# Altium schematic sheet ESP32 with USBC.SchDoc
size C; SheetNumber: 1; SheetTotal: 1
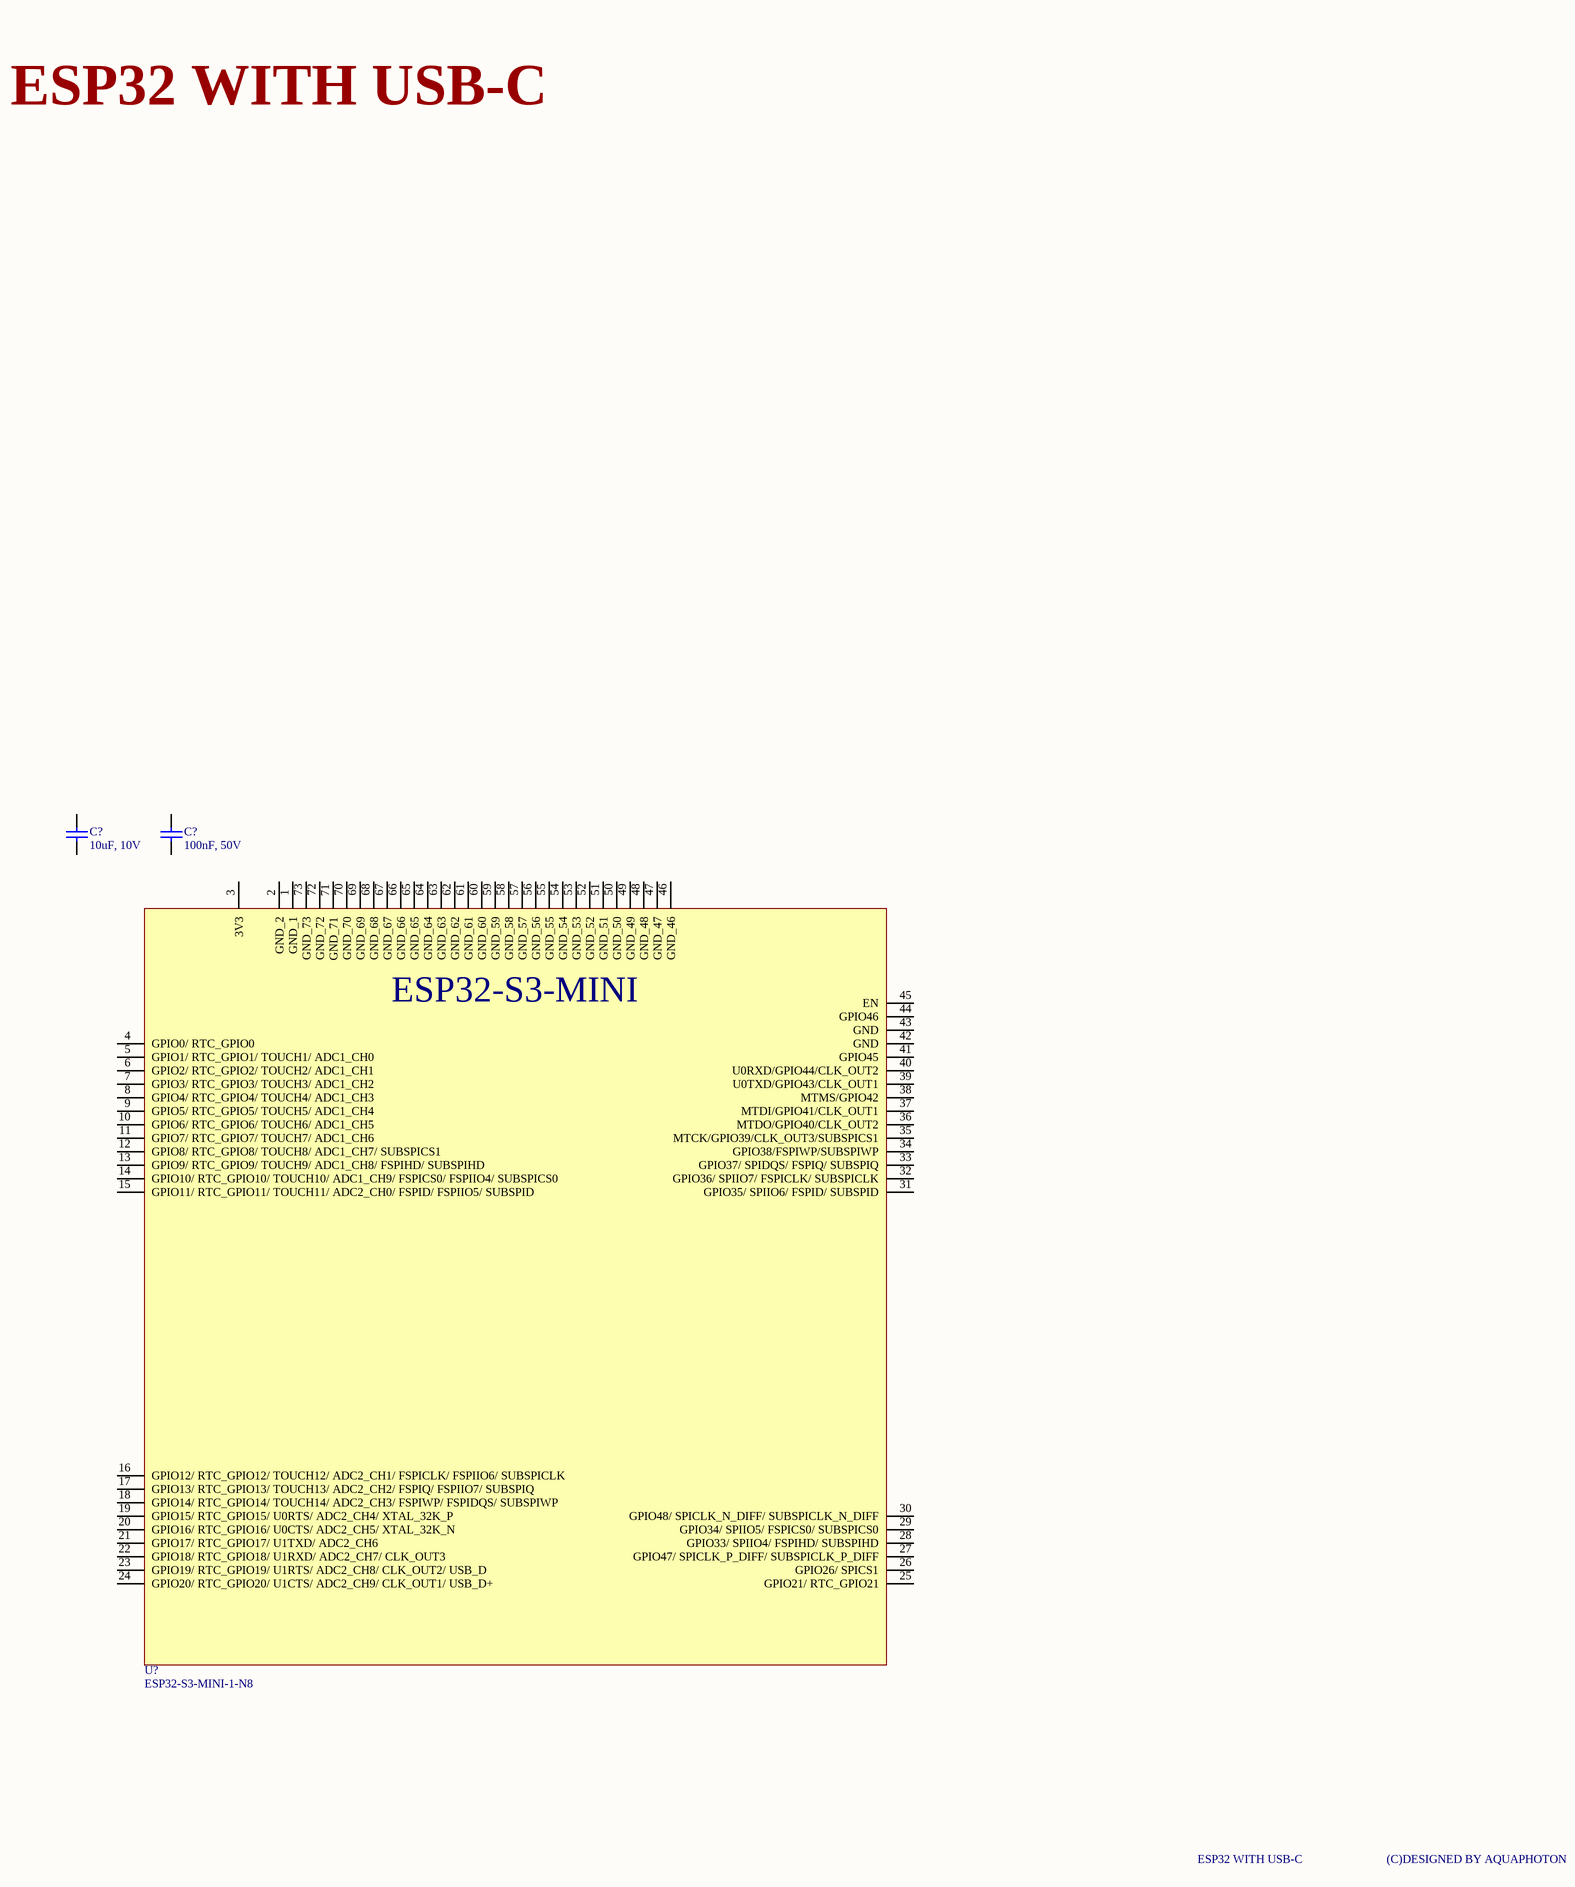
[diagram p0: ESP32 with USBC.SchDoc]

## Parts
(Parts that share a designator on the sheet are numbered #1, #2 ... from top to bottom, then left to right.)
C?#1  10uF, 10V
C?#2  100nF, 50V
U?  ESP32-S3-MINI-1-N8

## Nets

Not connected (* = marked no-connect by the designer): C?#1 1 2; C?#2 1 2; U? 1(GND_1) 2(GND_2) 3(3V3) 4(GPIO0/_RTC_GPIO0) 5(GPIO1/_RTC_GPIO1/_TOUCH1/_ADC1_CH0) 6(GPIO2/_RTC_GPIO2/_TOUCH2/_ADC1_CH1) 7(GPIO3/_RTC_GPIO3/_TOUCH3/_ADC1_CH2) 8(GPIO4/_RTC_GPIO4/_TOUCH4/_ADC1_CH3) 9(GPIO5/_RTC_GPIO5/_TOUCH5/_ADC1_CH4) 10(GPIO6/_RTC_GPIO6/_TOUCH6/_ADC1_CH5) 11(GPIO7/_RTC_GPIO7/_TOUCH7/_ADC1_CH6) 12(GPIO8/_RTC_GPIO8/_TOUCH8/_ADC1_CH7/_SUBSPICS1) 13(GPIO9/_RTC_GPIO9/_TOUCH9/_ADC1_CH8/_FSPIHD/_SUBSPIHD) 14(GPIO10/_RTC_GPIO10/_TOUCH10/_ADC1_CH9/_FSPICS0/_FSPIIO4/_SUBSPICS0) 15(GPIO11/_RTC_GPIO11/_TOUCH11/_ADC2_CH0/_FSPID/_FSPIIO5/_SUBSPID) 16(GPIO12/_RTC_GPIO12/_TOUCH12/_ADC2_CH1/_FSPICLK/_FSPIIO6/_SUBSPICLK) 17(GPIO13/_RTC_GPIO13/_TOUCH13/_ADC2_CH2/_FSPIQ/_FSPIIO7/_SUBSPIQ) 18(GPIO14/_RTC_GPIO14/_TOUCH14/_ADC2_CH3/_FSPIWP/_FSPIDQS/_SUBSPIWP) 19(GPIO15/_RTC_GPIO15/_U0RTS/_ADC2_CH4/_XTAL_32K_P) 20(GPIO16/_RTC_GPIO16/_U0CTS/_ADC2_CH5/_XTAL_32K_N) 21(GPIO17/_RTC_GPIO17/_U1TXD/_ADC2_CH6) 22(GPIO18/_RTC_GPIO18/_U1RXD/_ADC2_CH7/_CLK_OUT3) 23(GPIO19/_RTC_GPIO19/_U1RTS/_ADC2_CH8/_CLK_OUT2/_USB_D) 24(GPIO20/_RTC_GPIO20/_U1CTS/_ADC2_CH9/_CLK_OUT1/_USB_D+) 25(GPIO21/_RTC_GPIO21) 26(GPIO26/_SPICS1) 27(GPIO47/_SPICLK_P_DIFF/_SUBSPICLK_P_DIFF) 28(GPIO33/_SPIIO4/_FSPIHD/_SUBSPIHD) 29(GPIO34/_SPIIO5/_FSPICS0/_SUBSPICS0) 30(GPIO48/_SPICLK_N_DIFF/_SUBSPICLK_N_DIFF) 31(GPIO35/_SPIIO6/_FSPID/_SUBSPID) 32(GPIO36/_SPIIO7/_FSPICLK/_SUBSPICLK) 33(GPIO37/_SPIDQS/_FSPIQ/_SUBSPIQ) 34(GPIO38/FSPIWP/SUBSPIWP) 35(MTCK/GPIO39/CLK_OUT3/SUBSPICS1) 36(MTDO/GPIO40/CLK_OUT2) 37(MTDI/GPIO41/CLK_OUT1) 38(MTMS/GPIO42) 39(U0TXD/GPIO43/CLK_OUT1) 40(U0RXD/GPIO44/CLK_OUT2) 41(GPIO45) 42(GND) 43(GND) 44(GPIO46) 45(EN) 46(GND_46) 47(GND_47) 48(GND_48) 49(GND_49) 50(GND_50) 51(GND_51) 52(GND_52) 53(GND_53) 54(GND_54) 55(GND_55) 56(GND_56) 57(GND_57) 58(GND_58) 59(GND_59) 60(GND_60) 61(GND_61) 62(GND_62) 63(GND_63) 64(GND_64) 65(GND_65) 66(GND_66) 67(GND_67) 68(GND_68) 69(GND_69) 70(GND_70) 71(GND_71) 72(GND_72) 73(GND_73)

## Notes on the sheet
- ESP32 WITH USB-C
- (C)DESIGNED BY AQUAPHOTON
- (in symbol ESP32-S3-MINI-1-N8) ESP32-S3-MINI

## Library data of the parts
C?#1 = CL05A106MP8NUB8: 10V 10uF X5R ±20% 0402 Multilayer Ceramic Capacitors MLCC - SMD/SMT ROHS; Manufacturer: Samsung Electro-Mechanics; Supplier: LCSC; Supplier Part Number: C307415; Manufacturer Part Number: CL05A106MP8NUB8; ComponentLink1URL: https://datasheet.octopart.com:443/CL05A106MP8NUB8-Samsung-Electro-Mechanics-datasheet-136460857.pdf?src-supplier=IHS; ComponentLink1Description: https://datasheet.octopart.com:443/CL05A106MP8NUB8-Samsung-Electro-Mechanics-datasheet-136460857.pdf?src-supplier=IHS; ComponentLink2URL: https://datasheet.octopart.com:443/CL05A106MP8NUB8-Samsung-Electro-Mechanics-datasheet-181551178.pdf?src-supplier=Newark; ComponentLink2Description: https://datasheet.octopart.com:443/CL05A106MP8NUB8-Samsung-Electro-Mechanics-datasheet-181551178.pdf?src-supplier=Newark; ComponentLink3URL: https://datasheet.octopart.com:443/CL05A106MP8NUB8-Samsung-Electro-Mechanics-datasheet-136031724.pdf?src-supplier=Newark; ComponentLink3Description: https://datasheet.octopart.com:443/CL05A106MP8NUB8-Samsung-Electro-Mechanics-datasheet-136031724.pdf?src-supplier=Newark; ComponentLink4URL: https://datasheet.octopart.com:443/CL05A106MP8NUB8-Samsung-Electro-Mechanics-datasheet-141346815.pdf?src-supplier=Samsung+SCT; ComponentLink4Description: https://datasheet.octopart.com:443/CL05A106MP8NUB8-Samsung-Electro-Mechanics-datasheet-141346815.pdf?src-supplier=Samsung+SCT; ComponentLink5URL: https://datasheet.octopart.com:443/CL05A106MP8NUB8-Samsung-Electro-Mechanics-datasheet-110326781.pdf?src-supplier=Future+Electronics; ComponentLink5Description: https://datasheet.octopart.com:443/CL05A106MP8NUB8-Samsung-Electro-Mechanics-datasheet-110326781.pdf?src-supplier=Future+Electronics; ComponentLink6URL: https://datasheet.octopart.com:443/CL05A106MP8NUB8-Samsung-Electro-Mechanics-datasheet-96443587.pdf?src-supplier=Future+Electronics; ComponentLink6Description: https://datasheet.octopart.com:443/CL05A106MP8NUB8-Samsung-Electro-Mechanics-datasheet-96443587.pdf?src-supplier=Future+Electronics; ComponentLink7URL: https://datasheet.octopart.com:443/CL05A106MP8NUB8-Samsung-Electro-Mechanics-datasheet-68297032.pdf?src-supplier=Future+Electronics; ComponentLink7Description: https://datasheet.octopart.com:443/CL05A106MP8NUB8-Samsung-Electro-Mechanics-datasheet-68297032.pdf?src-supplier=Future+Electronics; ComponentLink8URL: https://datasheet.octopart.com:443/CL05A106MP8NUB8-Samsung-Electro-Mechanics-datasheet-86032222.pdf?src-supplier=Future+Electronics; ComponentLink8Description: https://datasheet.octopart.com:443/CL05A106MP8NUB8-Samsung-Electro-Mechanics-datasheet-86032222.pdf?src-supplier=Future+Electronics
C?#2 = CL05B104KB54PNC: 50V 100nF X7R ±10% 0402 Multilayer Ceramic Capacitors MLCC - SMD/SMT ROHS; Manufacturer: Samsung Electro-Mechanics; Supplier: LCSC; Supplier Part Number: C307331; Manufacturer Part Number: CL05B104KB54PNC; ComponentLink1URL: https://datasheet.octopart.com:443/CL05B104KB54PNC-Samsung-Electro-Mechanics-datasheet-182018727.pdf?src-supplier=IHS; ComponentLink1Description: https://datasheet.octopart.com:443/CL05B104KB54PNC-Samsung-Electro-Mechanics-datasheet-182018727.pdf?src-supplier=IHS; ComponentLink2URL: https://datasheet.octopart.com:443/CL05B104KB54PNC-Samsung-Electro-Mechanics-datasheet-138685816.pdf?src-supplier=Samsung+SCT; ComponentLink2Description: https://datasheet.octopart.com:443/CL05B104KB54PNC-Samsung-Electro-Mechanics-datasheet-138685816.pdf?src-supplier=Samsung+SCT; ComponentLink3URL: https://datasheet.octopart.com:443/CL05B104KB54PNC-Samsung-datasheet-8326407.pdf?src-supplier=TME; ComponentLink3Description: https://datasheet.octopart.com:443/CL05B104KB54PNC-Samsung-datasheet-8326407.pdf?src-supplier=TME
U? = ESP32-S3-MINI-1-N8: SMD module, ESP32-S3FN8, 8 MB SPI flash, PCB antenna; Manufacturer: Espressif Systems; Supplier: LCSC; Supplier Part Number: C2913206; Manufacturer Part Number: ESP32-S3-MINI-1-N8; ComponentLink1URL: https://datasheet.octopart.com:443/ESP32-S3-MINI-1-N8-Espressif-Systems-datasheet-188867343.pdf?src-supplier=TME; ComponentLink1Description: https://datasheet.octopart.com:443/ESP32-S3-MINI-1-N8-Espressif-Systems-datasheet-188867343.pdf?src-supplier=TME; ComponentLink2URL: https://datasheet.octopart.com:443/ESP32-S3-MINI-1-N8-Espressif-Systems-datasheet-165560562.pdf?src-supplier=TME; ComponentLink2Description: https://datasheet.octopart.com:443/ESP32-S3-MINI-1-N8-Espressif-Systems-datasheet-165560562.pdf?src-supplier=TME; ComponentLink3URL: https://datasheet.octopart.com:443/ESP32-S3-MINI-1-N8-Espressif-Systems-datasheet-165560559.pdf?src-supplier=TME; ComponentLink3Description: https://datasheet.octopart.com:443/ESP32-S3-MINI-1-N8-Espressif-Systems-datasheet-165560559.pdf?src-supplier=TME